# Altium schematic sheet supply.SchDoc
size A4
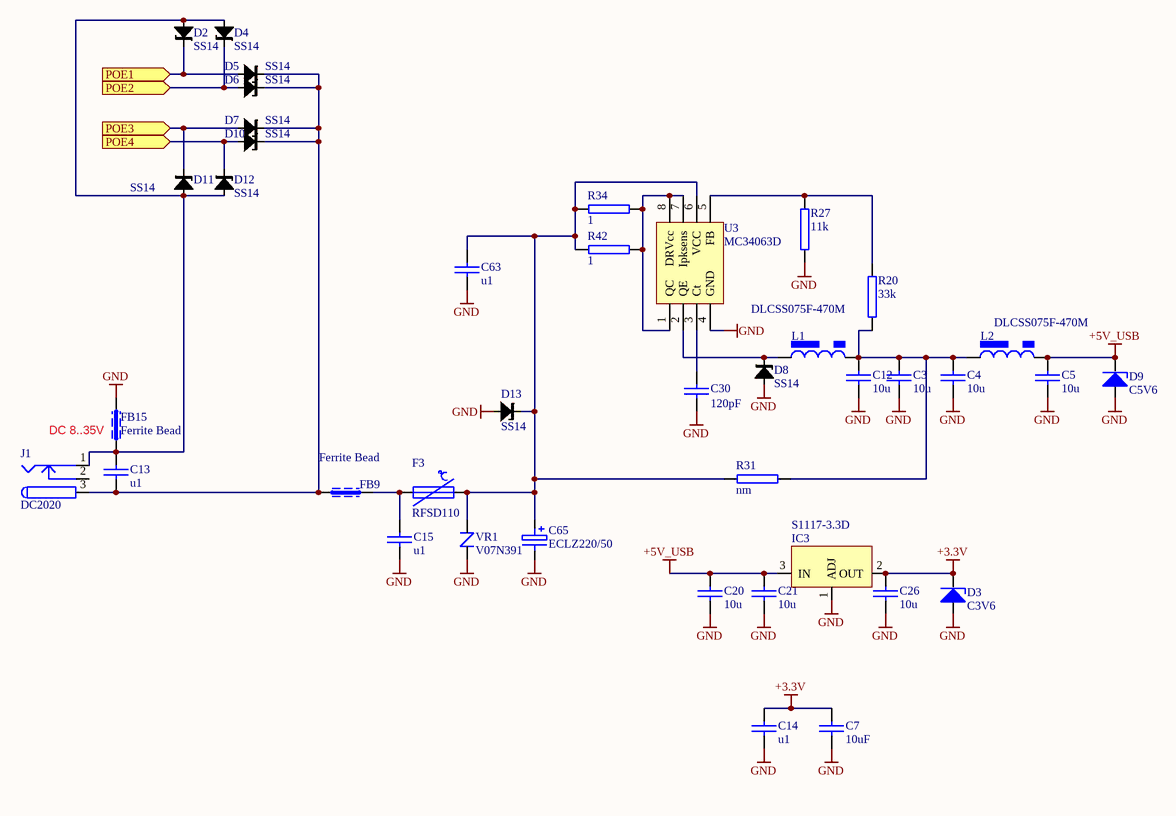
[diagram p0: supply.SchDoc]

## Parts
C3  10u  [0805]
C4  10u  [0805]
C5  10u  [0805]
C7  10uF  [0805]
C12  10u  [0805]
C13  u1  [0603]
C14  u1  [0603]
C15  u1  [0603]
C20  10u  [0805]
C21  10u  [0805]
C26  10u  [0805]
C30  120pF  [0603]
C63  u1  [0603]
C65  ECLZ220/50  [CAP_SMT_EL_10mm_G]
D2  SS14  [DO-214AC/SMA]
D3  C3V6  [SOD80]
D4  SS14  [DO-214AC/SMA]
D5  SS14  [DO-214AC/SMA]
D6  SS14  [DO-214AC/SMA]
D7  SS14  [DO-214AC/SMA]
D8  SS14  [DO-214AC/SMA]
D9  C5V6  [SOD80]
D10  SS14  [DO-214AC/SMA]
D11  SS14  [DO-214AC/SMA]
D12  SS14  [DO-214AC/SMA]
D13  SS14  [DO-214AC/SMA]
F3  RFSD110  [PTC_SMD_1812]
FB9  Ferrite Bead  [0603]
FB15  Ferrite Bead  [0603]
IC3  S1117-3.3D  [TO-252]
J1  DC2020  [DC2020]
L1  DLCSS075F-470M  [choke_DLSD75]
L2  DLCSS075F-470M  [choke_DLSD75]
R20  33k  [0603]
R27  11k  [0603]
R31  nm  [0603]
R34  1  [0603]
R42  1  [0603]
U3  MC34063D  [so-8]
VR1  V07N391  [Varistor_7mm]

## Ports
POE1 (in), POE2 (in), POE3 (in), POE4 (in)

## Nets
+3.3V: C7.1 C14.1 C26.1 D3.K IC3.2(OUT)
+5V_USB: C5.1 C20.1 C21.1 D9.K IC3.3(IN) L2.2
GND: C3.2 C4.2 C5.2 C7.2 C12.2 C14.2 C15.2 C20.2 C21.2 C26.2 C30.1 C63.2 C65.2 D3.A D8.A D9.A D13.A FB15.2 IC3.1(ADJ) R27.2 U3.4(GND) VR1.2
POE1: D2.K D5.A ; port POE1
POE2: D4.K D6.A ; port POE2
POE3: D7.A D11.K ; port POE3
POE4: D10.A D12.K ; port POE4
NetC3_1: C3.1 C4.1 C12.1 L1.2 L2.1 R20.2 R31.2
NetC13_1: C13.1 D2.A D4.A D11.A D12.A FB15.1 J1.1
NetC13_2: C13.2 D5.K D6.K D7.K D10.K FB9.1 J1.3
NetC15_1: C15.1 F3.1 FB9.2
NetC30_2: C30.2 U3.3(Ct)
NetC63_1: C63.1 C65.1 D13.K F3.2 R31.1 R34.1 R42.1 U3.6(VCC) VR1.1
NetD8_K: D8.K L1.1 U3.2(QE)
NetR20_1: R20.1 R27.1 U3.5(FB)
NetR34_2: R34.2 R42.2 U3.1(QC) U3.7(Ipksens) U3.8(DRVcc)

Not connected (* = marked no-connect by the designer): J1 2

## Notes on the sheet
- (near FB15) DC 8..35V

## Library data of the parts
C3-C5 C7 C12-C15 C20 C21 C26 C30 C63 = CAP_SMD: Capacitor SMD
C65 = CAP_ELECTRO_SMD: Electrolytic Capacitor
D2 D4-D8 D10-D13 = shottky_SS14_18: shottky diode (Maritex)
D3 D9 = ZENER1: Zener Diode
F3 = F_POLYSWITCH: polymer FUSE
FB9 FB15 = L_FERRITE_BEAD
IC3 = REG_S1117-3.3D: Voltage Regulator
J1 = CON_DC_JACK_TH: Low Voltage Power Supply Connector (maritex); Published: 17-Dec-2003; Datasheet: Latest Revision: 09-May-2002; Publisher: Altium Limited
L1 L2 = L_POWER_INDUCTOR_CSS075F: inductor
R20 R27 R31 R34 R42 = RES_SMD: SMD Resistor
U3 = MC34063A
VR1 = Varistor V07N: varistor 7mm (Maritex)